# Altium project ITA-PCB.PrjPcb
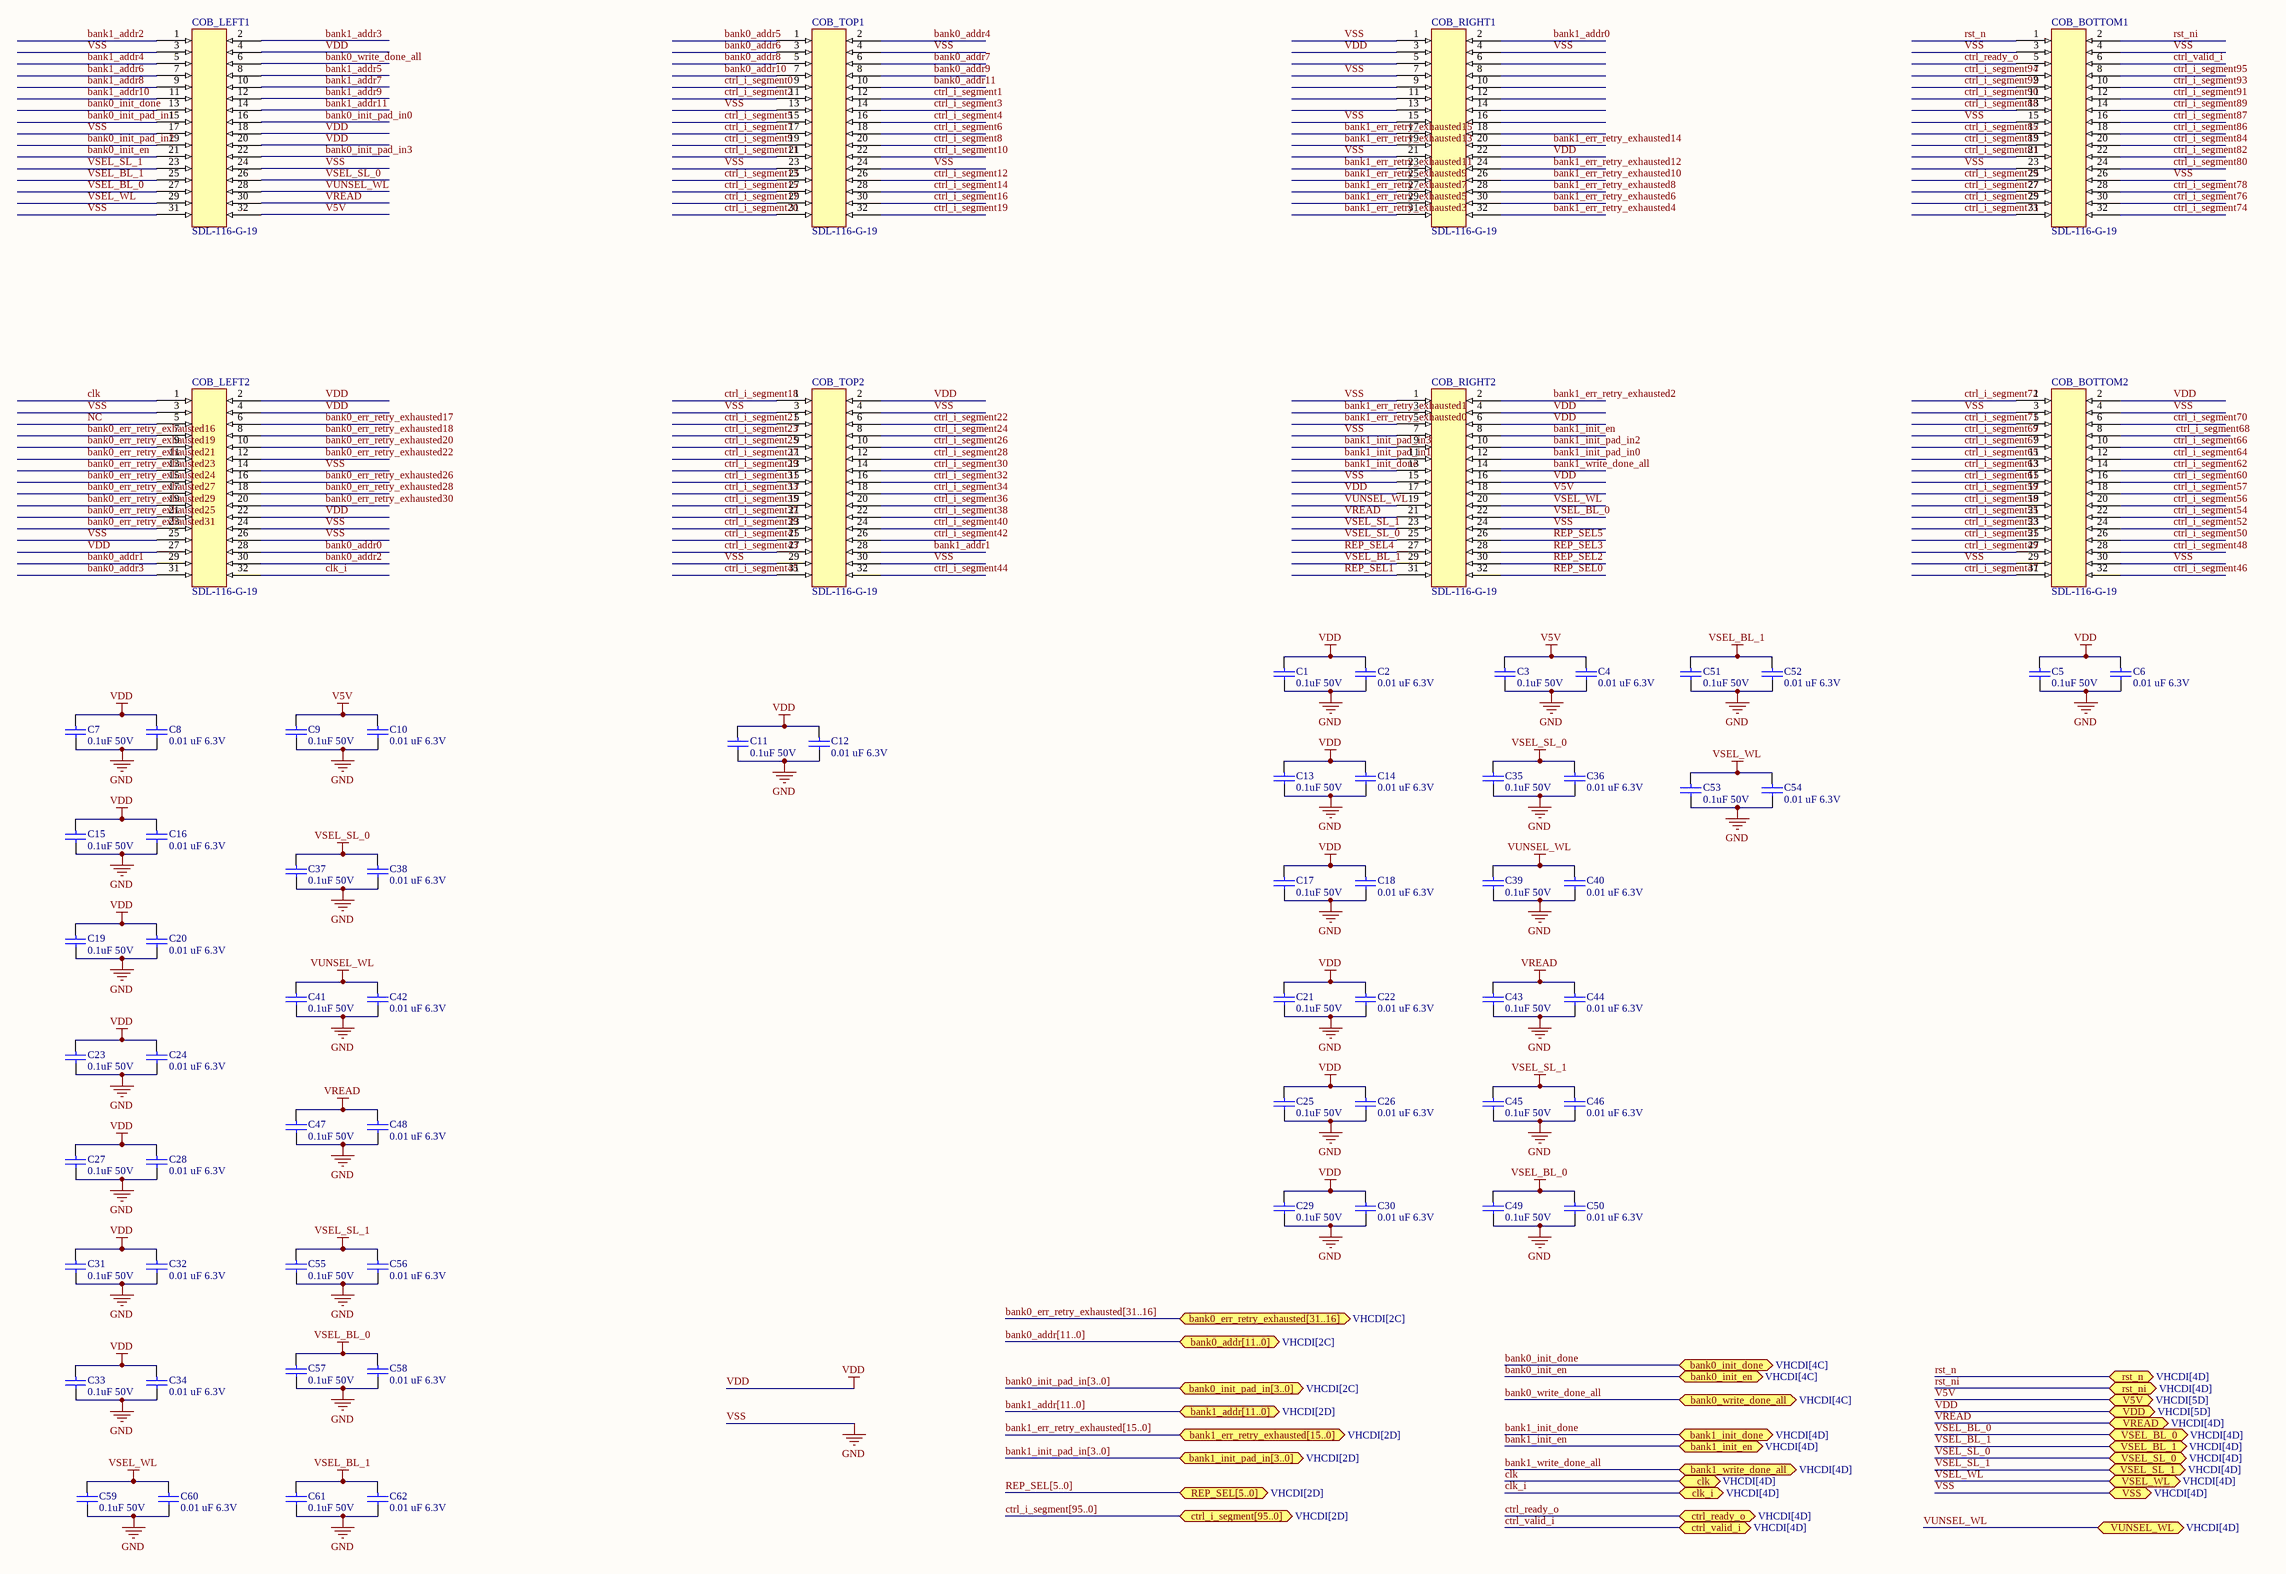
[diagram p0: COBConnector.SchDoc]
2 sheets, 77 parts. Net scope: flat (ports and power ports of the same name join across sheets).
Sheets:
  COBConnector.SchDoc
  VHCDI.SchDoc

## Sheet COBConnector.SchDoc
size C; SheetNumber: 2; SheetTotal: 2

### Parts
C1  0.1uF 50V  [C0603-XXXXXX-XXX]
C2  0.01 uF 6.3V  [C0603-XXXXXX-XXX]
C3  0.1uF 50V  [C0603-XXXXXX-XXX]
C4  0.01 uF 6.3V  [C0603-XXXXXX-XXX]
C5  0.1uF 50V  [C0603-XXXXXX-XXX]
C6  0.01 uF 6.3V  [C0603-XXXXXX-XXX]
C7  0.1uF 50V  [C0603-XXXXXX-XXX]
C8  0.01 uF 6.3V  [C0603-XXXXXX-XXX]
C9  0.1uF 50V  [C0603-XXXXXX-XXX]
C10  0.01 uF 6.3V  [C0603-XXXXXX-XXX]
C11  0.1uF 50V  [C0603-XXXXXX-XXX]
C12  0.01 uF 6.3V  [C0603-XXXXXX-XXX]
C13  0.1uF 50V  [C0603-XXXXXX-XXX]
C14  0.01 uF 6.3V  [C0603-XXXXXX-XXX]
C15  0.1uF 50V  [C0603-XXXXXX-XXX]
C16  0.01 uF 6.3V  [C0603-XXXXXX-XXX]
C17  0.1uF 50V  [C0603-XXXXXX-XXX]
C18  0.01 uF 6.3V  [C0603-XXXXXX-XXX]
C19  0.1uF 50V  [C0603-XXXXXX-XXX]
C20  0.01 uF 6.3V  [C0603-XXXXXX-XXX]
C21  0.1uF 50V  [C0603-XXXXXX-XXX]
C22  0.01 uF 6.3V  [C0603-XXXXXX-XXX]
C23  0.1uF 50V  [C0603-XXXXXX-XXX]
C24  0.01 uF 6.3V  [C0603-XXXXXX-XXX]
C25  0.1uF 50V  [C0603-XXXXXX-XXX]
C26  0.01 uF 6.3V  [C0603-XXXXXX-XXX]
C27  0.1uF 50V  [C0603-XXXXXX-XXX]
C28  0.01 uF 6.3V  [C0603-XXXXXX-XXX]
C29  0.1uF 50V  [C0603-XXXXXX-XXX]
C30  0.01 uF 6.3V  [C0603-XXXXXX-XXX]
C31  0.1uF 50V  [C0603-XXXXXX-XXX]
C32  0.01 uF 6.3V  [C0603-XXXXXX-XXX]
C33  0.1uF 50V  [C0603-XXXXXX-XXX]
C34  0.01 uF 6.3V  [C0603-XXXXXX-XXX]
C35  0.1uF 50V  [C0603-XXXXXX-XXX]
C36  0.01 uF 6.3V  [C0603-XXXXXX-XXX]
C37  0.1uF 50V  [C0603-XXXXXX-XXX]
C38  0.01 uF 6.3V  [C0603-XXXXXX-XXX]
C39  0.1uF 50V  [C0603-XXXXXX-XXX]
C40  0.01 uF 6.3V  [C0603-XXXXXX-XXX]
C41  0.1uF 50V  [C0603-XXXXXX-XXX]
C42  0.01 uF 6.3V  [C0603-XXXXXX-XXX]
C43  0.1uF 50V  [C0603-XXXXXX-XXX]
C44  0.01 uF 6.3V  [C0603-XXXXXX-XXX]
C45  0.1uF 50V  [C0603-XXXXXX-XXX]
C46  0.01 uF 6.3V  [C0603-XXXXXX-XXX]
C47  0.1uF 50V  [C0603-XXXXXX-XXX]
C48  0.01 uF 6.3V  [C0603-XXXXXX-XXX]
C49  0.1uF 50V  [C0603-XXXXXX-XXX]
C50  0.01 uF 6.3V  [C0603-XXXXXX-XXX]
C51  0.1uF 50V  [C0603-XXXXXX-XXX]
C52  0.01 uF 6.3V  [C0603-XXXXXX-XXX]
C53  0.1uF 50V  [C0603-XXXXXX-XXX]
C54  0.01 uF 6.3V  [C0603-XXXXXX-XXX]
C55  0.1uF 50V  [C0603-XXXXXX-XXX]
C56  0.01 uF 6.3V  [C0603-XXXXXX-XXX]
C57  0.1uF 50V  [C0603-XXXXXX-XXX]
C58  0.01 uF 6.3V  [C0603-XXXXXX-XXX]
C59  0.1uF 50V  [C0603-XXXXXX-XXX]
C60  0.01 uF 6.3V  [C0603-XXXXXX-XXX]
C61  0.1uF 50V  [C0603-XXXXXX-XXX]
C62  0.01 uF 6.3V  [C0603-XXXXXX-XXX]
COB_BOTTOM1  SDL-116-G-19  [CON32_2X16_TU_DSL_SAI]
COB_BOTTOM2  SDL-116-G-19  [CON32_2X16_TU_DSL_SAI]
COB_LEFT1  SDL-116-G-19  [CON32_2X16_TU_DSL_SAI]
COB_LEFT2  SDL-116-G-19  [CON32_2X16_TU_DSL_SAI]
COB_RIGHT1  SDL-116-G-19  [CON32_2X16_TU_DSL_SAI]
COB_RIGHT2  SDL-116-G-19  [CON32_2X16_TU_DSL_SAI]
COB_TOP1  SDL-116-G-19  [CON32_2X16_TU_DSL_SAI]
COB_TOP2  SDL-116-G-19  [CON32_2X16_TU_DSL_SAI]

### Ports
bank0_addr[11..0] (bidir, see VHCDI[2C]), bank0_err_retry_exhausted[31..16] (bidir, see VHCDI[2C]), bank0_init_done (bidir, see VHCDI[4C]), bank0_init_en (bidir, see VHCDI[4C]), bank0_init_pad_in[3..0] (bidir, see VHCDI[2C]), bank0_write_done_all (bidir, see VHCDI[4C]), bank1_addr[11..0] (bidir, see VHCDI[2D]), bank1_err_retry_exhausted[15..0] (bidir, see VHCDI[2D]), bank1_init_done (bidir, see VHCDI[4D]), bank1_init_en (bidir, see VHCDI[4D]), bank1_init_pad_in[3..0] (bidir, see VHCDI[2D]), bank1_write_done_all (bidir, see VHCDI[4D]), clk (bidir, see VHCDI[4D]), clk_i (bidir, see VHCDI[4D]), ctrl_i_segment[95..0] (bidir, see VHCDI[2D]), ctrl_ready_o (bidir, see VHCDI[4D]), ctrl_valid_i (bidir, see VHCDI[4D]), REP_SEL[5..0] (bidir, see VHCDI[2D]), rst_n (bidir, see VHCDI[4D]), rst_ni (bidir, see VHCDI[4D]), V5V (bidir, see VHCDI[5D]), VDD (bidir, see VHCDI[5D]), VREAD (bidir, see VHCDI[4D]), VSEL_BL_0 (bidir, see VHCDI[4D]), VSEL_BL_1 (bidir, see VHCDI[4D]), VSEL_SL_0 (bidir, see VHCDI[4D]), VSEL_SL_1 (bidir, see VHCDI[4D]), VSEL_WL (bidir, see VHCDI[4D]), VSS (bidir, see VHCDI[4D]), VUNSEL_WL (bidir, see VHCDI[4D])

### Nets
V5V: C3.1 C4.1 C9.1 C10.1 COB_LEFT1.32 COB_RIGHT2.18 ; port V5V
VDD: C1.1 C2.1 C5.1 C6.1 C7.1 C8.1 C11.1 C12.1 C13.1 C14.1 C15.1 C16.1 C17.1 C18.1 C19.1 C20.1 C21.1 C22.1 C23.1 C24.1 C25.1 C26.1 C27.1 C28.1 C29.1 C30.1 C31.1 C32.1 C33.1 C34.1 COB_BOTTOM2.2 COB_LEFT1.4 COB_LEFT1.18 COB_LEFT1.20 COB_LEFT2.2 COB_LEFT2.4 COB_LEFT2.22 COB_LEFT2.27 COB_RIGHT1.3 COB_RIGHT1.22 COB_RIGHT2.4 COB_RIGHT2.6 COB_RIGHT2.16 COB_RIGHT2.17 COB_TOP2.2 ; port VDD
VREAD: C43.1 C44.1 C47.1 C48.1 COB_LEFT1.30 COB_RIGHT2.21 ; port VREAD
VSEL_BL_0: C49.1 C50.1 C57.1 C58.1 COB_LEFT1.27 COB_RIGHT2.22 ; port VSEL_BL_0
VSEL_BL_1: C51.1 C52.1 C61.1 C62.1 COB_LEFT1.25 COB_RIGHT2.29 ; port VSEL_BL_1
VSEL_SL_0: C35.1 C36.1 C37.1 C38.1 COB_LEFT1.26 COB_RIGHT2.25 ; port VSEL_SL_0
VSEL_SL_1: C45.1 C46.1 C55.1 C56.1 COB_LEFT1.23 COB_RIGHT2.23 ; port VSEL_SL_1
VSEL_WL: C53.1 C54.1 C59.1 C60.1 COB_LEFT1.29 COB_RIGHT2.20 ; port VSEL_WL
VSS: C1.2 C2.2 C3.2 C4.2 C5.2 C6.2 C7.2 C8.2 C9.2 C10.2 C11.2 C12.2 C13.2 C14.2 C15.2 C16.2 C17.2 C18.2 C19.2 C20.2 C21.2 C22.2 C23.2 C24.2 C25.2 C26.2 C27.2 C28.2 C29.2 C30.2 C31.2 C32.2 C33.2 C34.2 C35.2 C36.2 C37.2 C38.2 C39.2 C40.2 C41.2 C42.2 C43.2 C44.2 C45.2 C46.2 C47.2 C48.2 C49.2 C50.2 C51.2 C52.2 C53.2 C54.2 C55.2 C56.2 C57.2 C58.2 C59.2 C60.2 C61.2 C62.2 COB_BOTTOM1.3 COB_BOTTOM1.4 COB_BOTTOM1.15 COB_BOTTOM1.23 COB_BOTTOM1.26 COB_BOTTOM2.3 COB_BOTTOM2.4 COB_BOTTOM2.29 COB_BOTTOM2.30 COB_LEFT1.3 COB_LEFT1.17 COB_LEFT1.24 COB_LEFT1.31 COB_LEFT2.3 COB_LEFT2.14 COB_LEFT2.24 COB_LEFT2.25 COB_LEFT2.26 COB_RIGHT1.1 COB_RIGHT1.4 COB_RIGHT1.7 COB_RIGHT1.15 COB_RIGHT1.21 COB_RIGHT2.1 COB_RIGHT2.7 COB_RIGHT2.15 COB_RIGHT2.24 COB_TOP1.4 COB_TOP1.13 COB_TOP1.23 COB_TOP1.24 COB_TOP2.3 COB_TOP2.4 COB_TOP2.29 COB_TOP2.30 ; port VSS  [also labelled GND]
VUNSEL_WL: C39.1 C40.1 C41.1 C42.1 COB_LEFT1.28 COB_RIGHT2.19 ; port VUNSEL_WL
bank0_addr0: COB_LEFT2.28
bank0_addr1: COB_LEFT2.29
bank0_addr2: COB_LEFT2.30
bank0_addr3: COB_LEFT2.31
bank0_addr4: COB_TOP1.2
bank0_addr5: COB_TOP1.1
bank0_addr6: COB_TOP1.3
bank0_addr7: COB_TOP1.6
bank0_addr8: COB_TOP1.5
bank0_addr9: COB_TOP1.8
bank0_addr10: COB_TOP1.7
bank0_addr11: COB_TOP1.10
bank0_err_retry_exhausted16: COB_LEFT2.7
bank0_err_retry_exhausted17: COB_LEFT2.6
bank0_err_retry_exhausted18: COB_LEFT2.8
bank0_err_retry_exhausted19: COB_LEFT2.9
bank0_err_retry_exhausted20: COB_LEFT2.10
bank0_err_retry_exhausted21: COB_LEFT2.11
bank0_err_retry_exhausted22: COB_LEFT2.12
bank0_err_retry_exhausted23: COB_LEFT2.13
bank0_err_retry_exhausted24: COB_LEFT2.15
bank0_err_retry_exhausted25: COB_LEFT2.21
bank0_err_retry_exhausted26: COB_LEFT2.16
bank0_err_retry_exhausted27: COB_LEFT2.17
bank0_err_retry_exhausted28: COB_LEFT2.18
bank0_err_retry_exhausted29: COB_LEFT2.19
bank0_err_retry_exhausted30: COB_LEFT2.20
bank0_err_retry_exhausted31: COB_LEFT2.23
bank0_init_done: COB_LEFT1.13 ; port bank0_init_done
bank0_init_en: COB_LEFT1.21 ; port bank0_init_en
bank0_init_pad_in0: COB_LEFT1.16
bank0_init_pad_in1: COB_LEFT1.15
bank0_init_pad_in2: COB_LEFT1.19
bank0_init_pad_in3: COB_LEFT1.22
bank0_write_done_all: COB_LEFT1.6 ; port bank0_write_done_all
bank1_addr0: COB_RIGHT1.2
bank1_addr1: COB_TOP2.28
bank1_addr2: COB_LEFT1.1
bank1_addr3: COB_LEFT1.2
bank1_addr4: COB_LEFT1.5
bank1_addr5: COB_LEFT1.8
bank1_addr6: COB_LEFT1.7
bank1_addr7: COB_LEFT1.10
bank1_addr8: COB_LEFT1.9
bank1_addr9: COB_LEFT1.12
bank1_addr10: COB_LEFT1.11
bank1_addr11: COB_LEFT1.14
bank1_err_retry_exhausted0: COB_RIGHT2.5
bank1_err_retry_exhausted1: COB_RIGHT2.3
bank1_err_retry_exhausted2: COB_RIGHT2.2
bank1_err_retry_exhausted3: COB_RIGHT1.31
bank1_err_retry_exhausted4: COB_RIGHT1.32
bank1_err_retry_exhausted5: COB_RIGHT1.29
bank1_err_retry_exhausted6: COB_RIGHT1.30
bank1_err_retry_exhausted7: COB_RIGHT1.27
bank1_err_retry_exhausted8: COB_RIGHT1.28
bank1_err_retry_exhausted9: COB_RIGHT1.25
bank1_err_retry_exhausted10: COB_RIGHT1.26
bank1_err_retry_exhausted11: COB_RIGHT1.23
bank1_err_retry_exhausted12: COB_RIGHT1.24
bank1_err_retry_exhausted13: COB_RIGHT1.19
bank1_err_retry_exhausted14: COB_RIGHT1.20
bank1_err_retry_exhausted15: COB_RIGHT1.17
bank1_init_done: COB_RIGHT2.13 ; port bank1_init_done
bank1_init_en: COB_RIGHT2.8 ; port bank1_init_en
bank1_init_pad_in0: COB_RIGHT2.12
bank1_init_pad_in1: COB_RIGHT2.11
bank1_init_pad_in2: COB_RIGHT2.10
bank1_init_pad_in3: COB_RIGHT2.9
bank1_write_done_all: COB_RIGHT2.14 ; port bank1_write_done_all
clk: COB_LEFT2.1 ; port clk
clk_i: COB_LEFT2.32 ; port clk_i
ctrl_i_segment0: COB_TOP1.9
ctrl_i_segment1: COB_TOP1.12
ctrl_i_segment2: COB_TOP1.11
ctrl_i_segment3: COB_TOP1.14
ctrl_i_segment4: COB_TOP1.16
ctrl_i_segment5: COB_TOP1.15
ctrl_i_segment6: COB_TOP1.18
ctrl_i_segment7: COB_TOP1.17
ctrl_i_segment8: COB_TOP1.20
ctrl_i_segment9: COB_TOP1.19
ctrl_i_segment10: COB_TOP1.22
ctrl_i_segment11: COB_TOP1.21
ctrl_i_segment12: COB_TOP1.26
ctrl_i_segment13: COB_TOP1.25
ctrl_i_segment14: COB_TOP1.28
ctrl_i_segment15: COB_TOP1.27
ctrl_i_segment16: COB_TOP1.30
ctrl_i_segment17: COB_TOP1.29
ctrl_i_segment18: COB_TOP2.1
ctrl_i_segment19: COB_TOP1.32
ctrl_i_segment20: COB_TOP1.31
ctrl_i_segment21: COB_TOP2.5
ctrl_i_segment22: COB_TOP2.6
ctrl_i_segment23: COB_TOP2.7
ctrl_i_segment24: COB_TOP2.8
ctrl_i_segment25: COB_TOP2.9
ctrl_i_segment26: COB_TOP2.10
ctrl_i_segment27: COB_TOP2.11
ctrl_i_segment28: COB_TOP2.12
ctrl_i_segment29: COB_TOP2.13
ctrl_i_segment30: COB_TOP2.14
ctrl_i_segment31: COB_TOP2.15
ctrl_i_segment32: COB_TOP2.16
ctrl_i_segment33: COB_TOP2.17
ctrl_i_segment34: COB_TOP2.18
ctrl_i_segment35: COB_TOP2.19
ctrl_i_segment36: COB_TOP2.20
ctrl_i_segment37: COB_TOP2.21
ctrl_i_segment38: COB_TOP2.22
ctrl_i_segment39: COB_TOP2.23
ctrl_i_segment40: COB_TOP2.24
ctrl_i_segment41: COB_TOP2.25
ctrl_i_segment42: COB_TOP2.26
ctrl_i_segment43: COB_TOP2.27
ctrl_i_segment44: COB_TOP2.32
ctrl_i_segment45: COB_TOP2.31
ctrl_i_segment46: COB_BOTTOM2.32
ctrl_i_segment47: COB_BOTTOM2.31
ctrl_i_segment48: COB_BOTTOM2.28
ctrl_i_segment49: COB_BOTTOM2.27
ctrl_i_segment50: COB_BOTTOM2.26
ctrl_i_segment51: COB_BOTTOM2.25
ctrl_i_segment52: COB_BOTTOM2.24
ctrl_i_segment53: COB_BOTTOM2.23
ctrl_i_segment54: COB_BOTTOM2.22
ctrl_i_segment55: COB_BOTTOM2.21
ctrl_i_segment56: COB_BOTTOM2.20
ctrl_i_segment57: COB_BOTTOM2.18
ctrl_i_segment58: COB_BOTTOM2.19
ctrl_i_segment59: COB_BOTTOM2.17
ctrl_i_segment60: COB_BOTTOM2.16
ctrl_i_segment61: COB_BOTTOM2.15
ctrl_i_segment62: COB_BOTTOM2.14
ctrl_i_segment63: COB_BOTTOM2.13
ctrl_i_segment64: COB_BOTTOM2.12
ctrl_i_segment65: COB_BOTTOM2.11
ctrl_i_segment66: COB_BOTTOM2.10
ctrl_i_segment67: COB_BOTTOM2.9
ctrl_i_segment68: COB_BOTTOM2.8
ctrl_i_segment69: COB_BOTTOM2.7
ctrl_i_segment70: COB_BOTTOM2.6
ctrl_i_segment71: COB_BOTTOM2.5
ctrl_i_segment72: COB_BOTTOM2.1
ctrl_i_segment73: COB_BOTTOM1.31
ctrl_i_segment74: COB_BOTTOM1.32
ctrl_i_segment75: COB_BOTTOM1.29
ctrl_i_segment76: COB_BOTTOM1.30
ctrl_i_segment77: COB_BOTTOM1.27
ctrl_i_segment78: COB_BOTTOM1.28
ctrl_i_segment79: COB_BOTTOM1.25
ctrl_i_segment80: COB_BOTTOM1.24
ctrl_i_segment81: COB_BOTTOM1.21
ctrl_i_segment82: COB_BOTTOM1.22
ctrl_i_segment83: COB_BOTTOM1.19
ctrl_i_segment84: COB_BOTTOM1.20
ctrl_i_segment85: COB_BOTTOM1.17
ctrl_i_segment86: COB_BOTTOM1.18
ctrl_i_segment87: COB_BOTTOM1.16
ctrl_i_segment88: COB_BOTTOM1.13
ctrl_i_segment89: COB_BOTTOM1.14
ctrl_i_segment90: COB_BOTTOM1.11
ctrl_i_segment91: COB_BOTTOM1.12
ctrl_i_segment92: COB_BOTTOM1.9
ctrl_i_segment93: COB_BOTTOM1.10
ctrl_i_segment94: COB_BOTTOM1.7
ctrl_i_segment95: COB_BOTTOM1.8
ctrl_ready_o: COB_BOTTOM1.5 ; port ctrl_ready_o
ctrl_valid_i: COB_BOTTOM1.6 ; port ctrl_valid_i
NC: COB_LEFT2.5
REP_SEL0: COB_RIGHT2.32
REP_SEL1: COB_RIGHT2.31
REP_SEL2: COB_RIGHT2.30
REP_SEL3: COB_RIGHT2.28
REP_SEL4: COB_RIGHT2.27
REP_SEL5: COB_RIGHT2.26
rst_n: COB_BOTTOM1.1 ; port rst_n
rst_ni: COB_BOTTOM1.2 ; port rst_ni

Not connected (* = marked no-connect by the designer): COB_RIGHT1 5 6 8 9 10 11 12 13 14 16 18

### Buses and harness runs
bus bank0_addr[11..0] = port bank0_addr[11..0]
bus bank0_err_retry_exhausted[31..16] = port bank0_err_retry_exhausted[31..16]
bus bank0_init_pad_in[3..0] = port bank0_init_pad_in[3..0]
bus bank1_addr[11..0] = port bank1_addr[11..0]
bus bank1_err_retry_exhausted[15..0] = port bank1_err_retry_exhausted[15..0]
bus bank1_init_pad_in[3..0] = port bank1_init_pad_in[3..0]
bus ctrl_i_segment[95..0] = port ctrl_i_segment[95..0]
bus REP_SEL[5..0] = port REP_SEL[5..0]

### Library data of the parts
C1 C3 C5 C7 C9 C11 C13 C15 C17 C19 C21 C23 C25 C27 C29 C31 C33 C35 C37 C39 C41 C43 C45 C47 C49 C51 C53 C55 C57 C59 C61 = C0603C104M5RAC7867: 0.1 µF ±20% 50V Ceramic Capacitor X7R 0603; KMI: 821327; Value: 0.1uF 50V
C2 C4 C6 C8 C10 C12 C14 C16 C18 C20 C22 C24 C26 C28 C30 C32 C34 C36 C38 C40 C42 C44 C46 C48 C50 C52 C54 C56 C58 C60 C62 = C0603F103M9RACTU: Multilayer Ceramic Capacitors MLCC - SMD/SMT 6.3V 0.01uF X7R 0603 20%; Value: 0.01 uF 6.3V

## Sheet VHCDI.SchDoc
size C; SheetNumber: 1; SheetTotal: 2
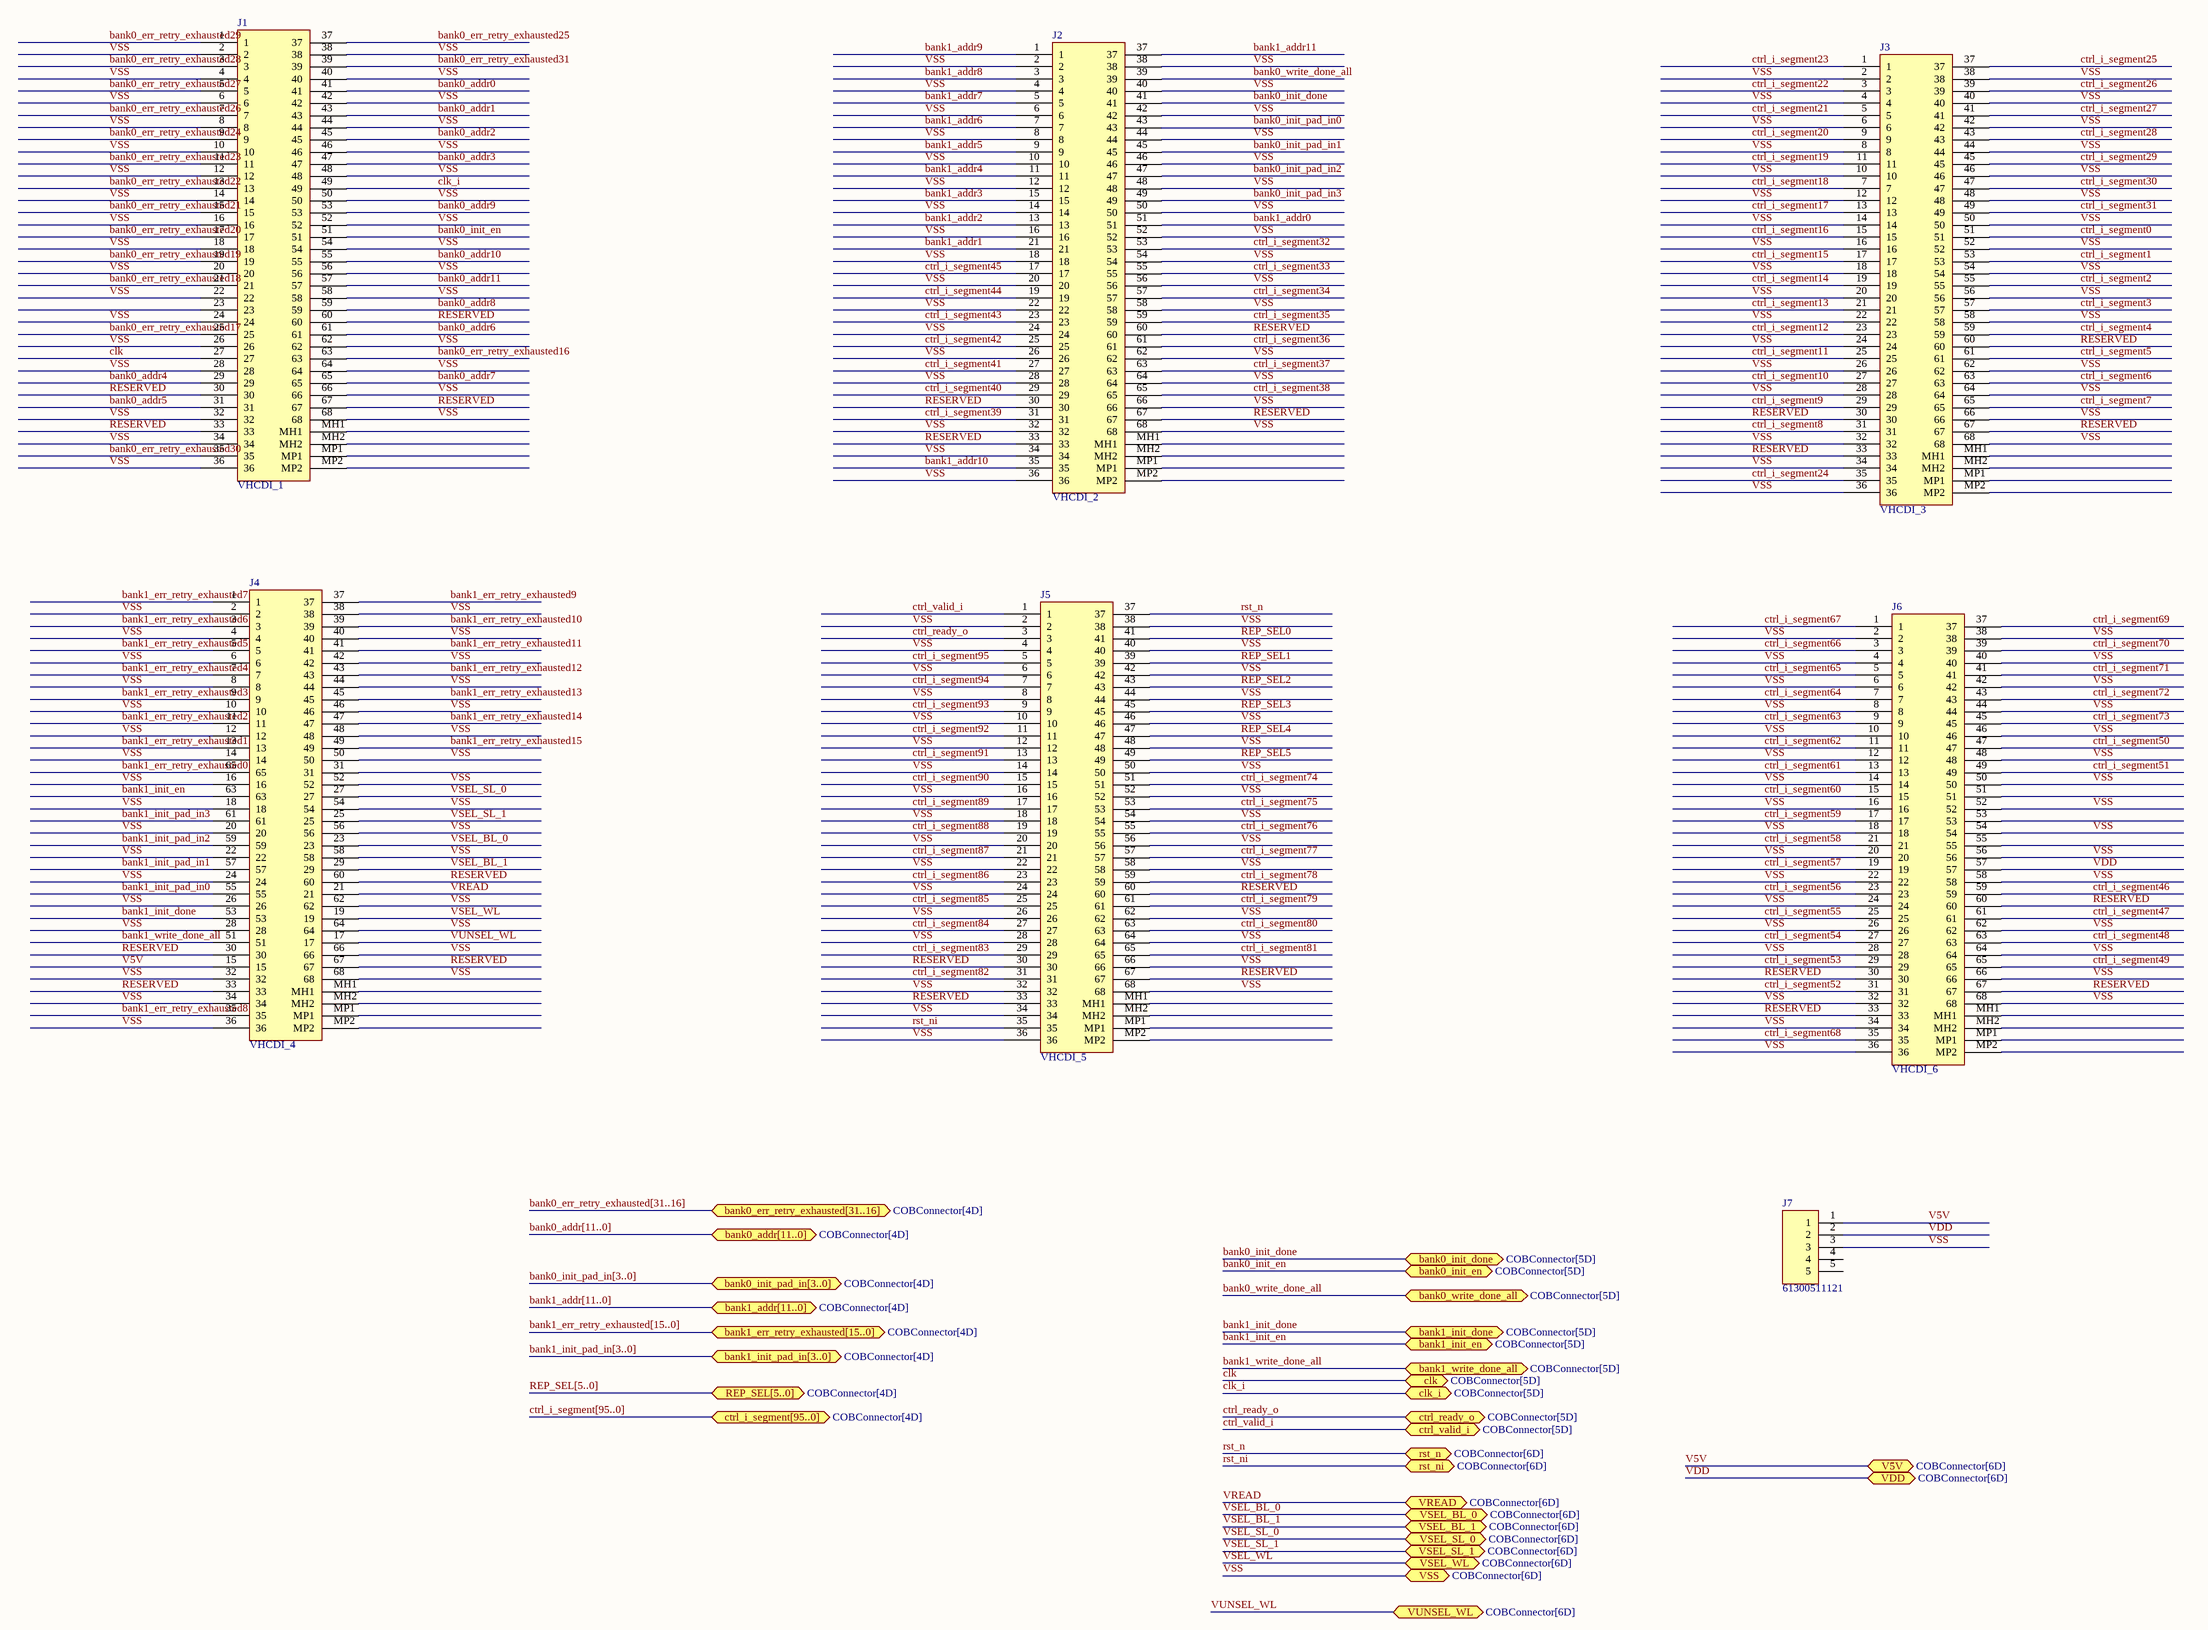
[diagram p1: VHCDI.SchDoc]

### Parts
J1  VHCDI_1  [CONN68_HDRA-EC_HON]
J2  VHCDI_2  [CONN68_HDRA-EC_HON]
J3  VHCDI_3  [CONN68_HDRA-EC_HON]
J4  VHCDI_4  [CONN68_HDRA-EC_HON]
J5  VHCDI_5  [CONN68_HDRA-EC_HON]
J6  VHCDI_6  [CONN68_HDRA-EC_HON]
J7  61300511121  [HDRV5W64P0X254_1X5_1270X254X854P]

### Ports
bank0_addr[11..0] (bidir, see COBConnector[4D]), bank0_err_retry_exhausted[31..16] (bidir, see COBConnector[4D]), bank0_init_done (bidir, see COBConnector[5D]), bank0_init_en (bidir, see COBConnector[5D]), bank0_init_pad_in[3..0] (bidir, see COBConnector[4D]), bank0_write_done_all (bidir, see COBConnector[5D]), bank1_addr[11..0] (bidir, see COBConnector[4D]), bank1_err_retry_exhausted[15..0] (bidir, see COBConnector[4D]), bank1_init_done (bidir, see COBConnector[5D]), bank1_init_en (bidir, see COBConnector[5D]), bank1_init_pad_in[3..0] (bidir, see COBConnector[4D]), bank1_write_done_all (bidir, see COBConnector[5D]), clk (bidir, see COBConnector[5D]), clk_i (bidir, see COBConnector[5D]), ctrl_i_segment[95..0] (bidir, see COBConnector[4D]), ctrl_ready_o (bidir, see COBConnector[5D]), ctrl_valid_i (bidir, see COBConnector[5D]), REP_SEL[5..0] (bidir, see COBConnector[4D]), rst_n (bidir, see COBConnector[6D]), rst_ni (bidir, see COBConnector[6D]), V5V (bidir, see COBConnector[6D]), VDD (bidir, see COBConnector[6D]), VREAD (bidir, see COBConnector[6D]), VSEL_BL_0 (bidir, see COBConnector[6D]), VSEL_BL_1 (bidir, see COBConnector[6D]), VSEL_SL_0 (bidir, see COBConnector[6D]), VSEL_SL_1 (bidir, see COBConnector[6D]), VSEL_WL (bidir, see COBConnector[6D]), VSS (bidir, see COBConnector[6D]), VUNSEL_WL (bidir, see COBConnector[6D])

### Nets
V5V: J4.15 J7.1 ; port V5V
VDD: J6.57 J7.2 ; port VDD
VREAD: J4.21 ; port VREAD
VSEL_BL_0: J4.23 ; port VSEL_BL_0
VSEL_BL_1: J4.29 ; port VSEL_BL_1
VSEL_SL_0: J4.27 ; port VSEL_SL_0
VSEL_SL_1: J4.25 ; port VSEL_SL_1
VSEL_WL: J4.19 ; port VSEL_WL
VSS: J1.2 J1.4 J1.6 J1.8 J1.10 J1.12 J1.14 J1.16 J1.18 J1.20 J1.22 J1.24 J1.26 J1.28 J1.32 J1.34 J1.36 J1.38 J1.40 J1.42 J1.44 J1.46 J1.48 J1.50 J1.52 J1.54 J1.56 J1.58 J1.62 J1.64 J1.66 J1.68 J2.2 J2.4 J2.6 J2.8 J2.10 J2.12 J2.14 J2.16 J2.18 J2.20 J2.22 J2.24 J2.26 J2.28 J2.32 J2.34 J2.36 J2.38 J2.40 J2.42 J2.44 J2.46 J2.48 J2.50 J2.52 J2.54 J2.56 J2.58 J2.62 J2.64 J2.66 J2.68 J3.2 J3.4 J3.6 J3.8 J3.10 J3.12 J3.14 J3.16 J3.18 J3.20 J3.22 J3.24 J3.26 J3.28 J3.32 J3.34 J3.36 J3.38 J3.40 J3.42 J3.44 J3.46 J3.48 J3.50 J3.52 J3.54 J3.56 J3.58 J3.62 J3.64 J3.66 J3.68 J4.2 J4.4 J4.6 J4.8 J4.10 J4.12 J4.14 J4.16 J4.18 J4.20 J4.22 J4.24 J4.26 J4.28 J4.32 J4.34 J4.36 J4.38 J4.40 J4.42 J4.44 J4.46 J4.48 J4.50 J4.52 J4.54 J4.56 J4.58 J4.62 J4.64 J4.66 J4.68 J5.2 J5.4 J5.6 J5.8 J5.10 J5.12 J5.14 J5.16 J5.18 J5.20 J5.22 J5.24 J5.26 J5.28 J5.32 J5.34 J5.36 J5.38 J5.40 J5.42 J5.44 J5.46 J5.48 J5.50 J5.52 J5.54 J5.56 J5.58 J5.62 J5.64 J5.66 J5.68 J6.2 J6.4 J6.6 J6.8 J6.10 J6.12 J6.14 J6.16 J6.18 J6.20 J6.22 J6.24 J6.26 J6.28 J6.32 J6.34 J6.36 J6.38 J6.40 J6.42 J6.44 J6.46 J6.48 J6.50 J6.52 J6.54 J6.56 J6.58 J6.62 J6.64 J6.66 J6.68 J7.3 ; port VSS
VUNSEL_WL: J4.17 ; port VUNSEL_WL
bank0_addr0: J1.41
bank0_addr1: J1.43
bank0_addr2: J1.45
bank0_addr3: J1.47
bank0_addr4: J1.29
bank0_addr5: J1.31
bank0_addr6: J1.61
bank0_addr7: J1.65
bank0_addr8: J1.59
bank0_addr9: J1.53
bank0_addr10: J1.55
bank0_addr11: J1.57
bank0_err_retry_exhausted16: J1.63
bank0_err_retry_exhausted17: J1.25
bank0_err_retry_exhausted18: J1.21
bank0_err_retry_exhausted19: J1.19
bank0_err_retry_exhausted20: J1.17
bank0_err_retry_exhausted21: J1.15
bank0_err_retry_exhausted22: J1.13
bank0_err_retry_exhausted23: J1.11
bank0_err_retry_exhausted24: J1.9
bank0_err_retry_exhausted25: J1.37
bank0_err_retry_exhausted26: J1.7
bank0_err_retry_exhausted27: J1.5
bank0_err_retry_exhausted28: J1.3
bank0_err_retry_exhausted29: J1.1
bank0_err_retry_exhausted30: J1.35
bank0_err_retry_exhausted31: J1.39
bank0_init_done: J2.41 ; port bank0_init_done
bank0_init_en: J1.51 ; port bank0_init_en
bank0_init_pad_in0: J2.43
bank0_init_pad_in1: J2.45
bank0_init_pad_in2: J2.47
bank0_init_pad_in3: J2.49
bank0_write_done_all: J2.39 ; port bank0_write_done_all
bank1_addr0: J2.51
bank1_addr1: J2.21
bank1_addr2: J2.13
bank1_addr3: J2.15
bank1_addr4: J2.11
bank1_addr5: J2.9
bank1_addr6: J2.7
bank1_addr7: J2.5
bank1_addr8: J2.3
bank1_addr9: J2.1
bank1_addr10: J2.35
bank1_addr11: J2.37
bank1_err_retry_exhausted0: J4.65
bank1_err_retry_exhausted1: J4.13
bank1_err_retry_exhausted2: J4.11
bank1_err_retry_exhausted3: J4.9
bank1_err_retry_exhausted4: J4.7
bank1_err_retry_exhausted5: J4.5
bank1_err_retry_exhausted6: J4.3
bank1_err_retry_exhausted7: J4.1
bank1_err_retry_exhausted8: J4.35
bank1_err_retry_exhausted9: J4.37
bank1_err_retry_exhausted10: J4.39
bank1_err_retry_exhausted11: J4.41
bank1_err_retry_exhausted12: J4.43
bank1_err_retry_exhausted13: J4.45
bank1_err_retry_exhausted14: J4.47
bank1_err_retry_exhausted15: J4.49
bank1_init_done: J4.53 ; port bank1_init_done
bank1_init_en: J4.63 ; port bank1_init_en
bank1_init_pad_in0: J4.55
bank1_init_pad_in1: J4.57
bank1_init_pad_in2: J4.59
bank1_init_pad_in3: J4.61
bank1_write_done_all: J4.51 ; port bank1_write_done_all
clk: J1.27 ; port clk
clk_i: J1.49 ; port clk_i
ctrl_i_segment0: J3.51
ctrl_i_segment1: J3.53
ctrl_i_segment2: J3.55
ctrl_i_segment3: J3.57
ctrl_i_segment4: J3.59
ctrl_i_segment5: J3.61
ctrl_i_segment6: J3.63
ctrl_i_segment7: J3.65
ctrl_i_segment8: J3.31
ctrl_i_segment9: J3.29
ctrl_i_segment10: J3.27
ctrl_i_segment11: J3.25
ctrl_i_segment12: J3.23
ctrl_i_segment13: J3.21
ctrl_i_segment14: J3.19
ctrl_i_segment15: J3.17
ctrl_i_segment16: J3.15
ctrl_i_segment17: J3.13
ctrl_i_segment18: J3.7
ctrl_i_segment19: J3.11
ctrl_i_segment20: J3.9
ctrl_i_segment21: J3.5
ctrl_i_segment22: J3.3
ctrl_i_segment23: J3.1
ctrl_i_segment24: J3.35
ctrl_i_segment25: J3.37
ctrl_i_segment26: J3.39
ctrl_i_segment27: J3.41
ctrl_i_segment28: J3.43
ctrl_i_segment29: J3.45
ctrl_i_segment30: J3.47
ctrl_i_segment31: J3.49
ctrl_i_segment32: J2.53
ctrl_i_segment33: J2.55
ctrl_i_segment34: J2.57
ctrl_i_segment35: J2.59
ctrl_i_segment36: J2.61
ctrl_i_segment37: J2.63
ctrl_i_segment38: J2.65
ctrl_i_segment39: J2.31
ctrl_i_segment40: J2.29
ctrl_i_segment41: J2.27
ctrl_i_segment42: J2.25
ctrl_i_segment43: J2.23
ctrl_i_segment44: J2.19
ctrl_i_segment45: J2.17
ctrl_i_segment46: J6.59
ctrl_i_segment47: J6.61
ctrl_i_segment48: J6.63
ctrl_i_segment49: J6.65
ctrl_i_segment50: J6.47
ctrl_i_segment51: J6.49
ctrl_i_segment52: J6.31
ctrl_i_segment53: J6.29
ctrl_i_segment54: J6.27
ctrl_i_segment55: J6.25
ctrl_i_segment56: J6.23
ctrl_i_segment57: J6.19
ctrl_i_segment58: J6.21
ctrl_i_segment59: J6.17
ctrl_i_segment60: J6.15
ctrl_i_segment61: J6.13
ctrl_i_segment62: J6.11
ctrl_i_segment63: J6.9
ctrl_i_segment64: J6.7
ctrl_i_segment65: J6.5
ctrl_i_segment66: J6.3
ctrl_i_segment67: J6.1
ctrl_i_segment68: J6.35
ctrl_i_segment69: J6.37
ctrl_i_segment70: J6.39
ctrl_i_segment71: J6.41
ctrl_i_segment72: J6.43
ctrl_i_segment73: J6.45
ctrl_i_segment74: J5.51
ctrl_i_segment75: J5.53
ctrl_i_segment76: J5.55
ctrl_i_segment77: J5.57
ctrl_i_segment78: J5.59
ctrl_i_segment79: J5.61
ctrl_i_segment80: J5.63
ctrl_i_segment81: J5.65
ctrl_i_segment82: J5.31
ctrl_i_segment83: J5.29
ctrl_i_segment84: J5.27
ctrl_i_segment85: J5.25
ctrl_i_segment86: J5.23
ctrl_i_segment87: J5.21
ctrl_i_segment88: J5.19
ctrl_i_segment89: J5.17
ctrl_i_segment90: J5.15
ctrl_i_segment91: J5.13
ctrl_i_segment92: J5.11
ctrl_i_segment93: J5.9
ctrl_i_segment94: J5.7
ctrl_i_segment95: J5.5
ctrl_ready_o: J5.3 ; port ctrl_ready_o
ctrl_valid_i: J5.1 ; port ctrl_valid_i
REP_SEL0: J5.41
REP_SEL1: J5.39
REP_SEL2: J5.43
REP_SEL3: J5.45
REP_SEL4: J5.47
REP_SEL5: J5.49
RESERVED: J1.30 J1.33 J1.60 J1.67 J2.30 J2.33 J2.60 J2.67 J3.30 J3.33 J3.60 J3.67 J4.30 J4.33 J4.60 J4.67 J5.30 J5.33 J5.60 J5.67 J6.30 J6.33 J6.60 J6.67
rst_n: J5.37 ; port rst_n
rst_ni: J5.35 ; port rst_ni

Not connected (* = marked no-connect by the designer): J1 23 MH1 MH2 MP1 MP2; J2 MH1 MH2 MP1 MP2; J3 MH1 MH2 MP1 MP2; J4 31 MH1 MH2 MP1 MP2; J5 MH1 MH2 MP1 MP2; J6 51 53 55 MH1 MH2 MP1 MP2; J7 4 5

### Buses and harness runs
bus bank0_addr[11..0] = port bank0_addr[11..0]
bus bank0_err_retry_exhausted[31..16] = port bank0_err_retry_exhausted[31..16]
bus bank0_init_pad_in[3..0] = port bank0_init_pad_in[3..0]
bus bank1_addr[11..0] = port bank1_addr[11..0]
bus bank1_err_retry_exhausted[15..0] = port bank1_err_retry_exhausted[15..0]
bus bank1_init_pad_in[3..0] = port bank1_init_pad_in[3..0]
bus ctrl_i_segment[95..0] = port ctrl_i_segment[95..0]
bus REP_SEL[5..0] = port REP_SEL[5..0]

### Library data of the parts
J1-J6 = 785633-01: Connector; Manufacturer_Name: NI; Datasheet Link: https://www.digikey.com/en/products/detail/ni/785633-01/16637125?s=N4IgTCBcDaIOwA4CsA2AzGkBdAvkA; Height: 10.8mm; Manufacturer_Part_Number: 785633-01
J7 = 61300511121: Connector; Manufacturer_Name: Wurth Elektronik; Datasheet Link: http://katalog.we-online.de/em/datasheet/6130xx11121.pdf; Height: 8.54mm; Manufacturer_Part_Number: 61300511121; Mouser Part Number: 710-61300511121; Mouser Price/Stock: https://www.mouser.co.uk/ProductDetail/Wurth-Elektronik/61300511121?qs=PhR8RmCirEZCsCRHq%252BvfRQ%3D%3D

## Nets that join several sheets
V5V: COBConnector (6 pins), VHCDI (J4.15 J7.1)
VDD: COBConnector (45 pins), VHCDI (J6.57 J7.2)
VREAD: COBConnector (6 pins), VHCDI (J4.21)
VSEL_BL_0: COBConnector (6 pins), VHCDI (J4.23)
VSEL_BL_1: COBConnector (6 pins), VHCDI (J4.29)
VSEL_SL_0: COBConnector (6 pins), VHCDI (J4.27)
VSEL_SL_1: COBConnector (6 pins), VHCDI (J4.25)
VSEL_WL: COBConnector (6 pins), VHCDI (J4.19)
VSS: COBConnector (97 pins), VHCDI (193 pins)
VUNSEL_WL: COBConnector (6 pins), VHCDI (J4.17)
bank0_addr0: COBConnector (COB_LEFT2.28), VHCDI (J1.41)
bank0_addr1: COBConnector (COB_LEFT2.29), VHCDI (J1.43)
bank0_addr2: COBConnector (COB_LEFT2.30), VHCDI (J1.45)
bank0_addr3: COBConnector (COB_LEFT2.31), VHCDI (J1.47)
bank0_addr4: COBConnector (COB_TOP1.2), VHCDI (J1.29)
bank0_addr5: COBConnector (COB_TOP1.1), VHCDI (J1.31)
bank0_addr6: COBConnector (COB_TOP1.3), VHCDI (J1.61)
bank0_addr7: COBConnector (COB_TOP1.6), VHCDI (J1.65)
bank0_addr8: COBConnector (COB_TOP1.5), VHCDI (J1.59)
bank0_addr9: COBConnector (COB_TOP1.8), VHCDI (J1.53)
bank0_addr10: COBConnector (COB_TOP1.7), VHCDI (J1.55)
bank0_addr11: COBConnector (COB_TOP1.10), VHCDI (J1.57)
bank0_err_retry_exhausted16: COBConnector (COB_LEFT2.7), VHCDI (J1.63)
bank0_err_retry_exhausted17: COBConnector (COB_LEFT2.6), VHCDI (J1.25)
bank0_err_retry_exhausted18: COBConnector (COB_LEFT2.8), VHCDI (J1.21)
bank0_err_retry_exhausted19: COBConnector (COB_LEFT2.9), VHCDI (J1.19)
bank0_err_retry_exhausted20: COBConnector (COB_LEFT2.10), VHCDI (J1.17)
bank0_err_retry_exhausted21: COBConnector (COB_LEFT2.11), VHCDI (J1.15)
bank0_err_retry_exhausted22: COBConnector (COB_LEFT2.12), VHCDI (J1.13)
bank0_err_retry_exhausted23: COBConnector (COB_LEFT2.13), VHCDI (J1.11)
bank0_err_retry_exhausted24: COBConnector (COB_LEFT2.15), VHCDI (J1.9)
bank0_err_retry_exhausted25: COBConnector (COB_LEFT2.21), VHCDI (J1.37)
bank0_err_retry_exhausted26: COBConnector (COB_LEFT2.16), VHCDI (J1.7)
bank0_err_retry_exhausted27: COBConnector (COB_LEFT2.17), VHCDI (J1.5)
bank0_err_retry_exhausted28: COBConnector (COB_LEFT2.18), VHCDI (J1.3)
bank0_err_retry_exhausted29: COBConnector (COB_LEFT2.19), VHCDI (J1.1)
bank0_err_retry_exhausted30: COBConnector (COB_LEFT2.20), VHCDI (J1.35)
bank0_err_retry_exhausted31: COBConnector (COB_LEFT2.23), VHCDI (J1.39)
bank0_init_done: COBConnector (COB_LEFT1.13), VHCDI (J2.41)
bank0_init_en: COBConnector (COB_LEFT1.21), VHCDI (J1.51)
bank0_init_pad_in0: COBConnector (COB_LEFT1.16), VHCDI (J2.43)
bank0_init_pad_in1: COBConnector (COB_LEFT1.15), VHCDI (J2.45)
bank0_init_pad_in2: COBConnector (COB_LEFT1.19), VHCDI (J2.47)
bank0_init_pad_in3: COBConnector (COB_LEFT1.22), VHCDI (J2.49)
bank0_write_done_all: COBConnector (COB_LEFT1.6), VHCDI (J2.39)
bank1_addr0: COBConnector (COB_RIGHT1.2), VHCDI (J2.51)
bank1_addr1: COBConnector (COB_TOP2.28), VHCDI (J2.21)
bank1_addr2: COBConnector (COB_LEFT1.1), VHCDI (J2.13)
bank1_addr3: COBConnector (COB_LEFT1.2), VHCDI (J2.15)
bank1_addr4: COBConnector (COB_LEFT1.5), VHCDI (J2.11)
bank1_addr5: COBConnector (COB_LEFT1.8), VHCDI (J2.9)
bank1_addr6: COBConnector (COB_LEFT1.7), VHCDI (J2.7)
bank1_addr7: COBConnector (COB_LEFT1.10), VHCDI (J2.5)
bank1_addr8: COBConnector (COB_LEFT1.9), VHCDI (J2.3)
bank1_addr9: COBConnector (COB_LEFT1.12), VHCDI (J2.1)
bank1_addr10: COBConnector (COB_LEFT1.11), VHCDI (J2.35)
bank1_addr11: COBConnector (COB_LEFT1.14), VHCDI (J2.37)
bank1_err_retry_exhausted0: COBConnector (COB_RIGHT2.5), VHCDI (J4.65)
bank1_err_retry_exhausted1: COBConnector (COB_RIGHT2.3), VHCDI (J4.13)
bank1_err_retry_exhausted2: COBConnector (COB_RIGHT2.2), VHCDI (J4.11)
bank1_err_retry_exhausted3: COBConnector (COB_RIGHT1.31), VHCDI (J4.9)
bank1_err_retry_exhausted4: COBConnector (COB_RIGHT1.32), VHCDI (J4.7)
bank1_err_retry_exhausted5: COBConnector (COB_RIGHT1.29), VHCDI (J4.5)
bank1_err_retry_exhausted6: COBConnector (COB_RIGHT1.30), VHCDI (J4.3)
bank1_err_retry_exhausted7: COBConnector (COB_RIGHT1.27), VHCDI (J4.1)
bank1_err_retry_exhausted8: COBConnector (COB_RIGHT1.28), VHCDI (J4.35)
bank1_err_retry_exhausted9: COBConnector (COB_RIGHT1.25), VHCDI (J4.37)
bank1_err_retry_exhausted10: COBConnector (COB_RIGHT1.26), VHCDI (J4.39)
bank1_err_retry_exhausted11: COBConnector (COB_RIGHT1.23), VHCDI (J4.41)
bank1_err_retry_exhausted12: COBConnector (COB_RIGHT1.24), VHCDI (J4.43)
bank1_err_retry_exhausted13: COBConnector (COB_RIGHT1.19), VHCDI (J4.45)
bank1_err_retry_exhausted14: COBConnector (COB_RIGHT1.20), VHCDI (J4.47)
bank1_err_retry_exhausted15: COBConnector (COB_RIGHT1.17), VHCDI (J4.49)
bank1_init_done: COBConnector (COB_RIGHT2.13), VHCDI (J4.53)
bank1_init_en: COBConnector (COB_RIGHT2.8), VHCDI (J4.63)
bank1_init_pad_in0: COBConnector (COB_RIGHT2.12), VHCDI (J4.55)
bank1_init_pad_in1: COBConnector (COB_RIGHT2.11), VHCDI (J4.57)
bank1_init_pad_in2: COBConnector (COB_RIGHT2.10), VHCDI (J4.59)
bank1_init_pad_in3: COBConnector (COB_RIGHT2.9), VHCDI (J4.61)
bank1_write_done_all: COBConnector (COB_RIGHT2.14), VHCDI (J4.51)
clk: COBConnector (COB_LEFT2.1), VHCDI (J1.27)
clk_i: COBConnector (COB_LEFT2.32), VHCDI (J1.49)
ctrl_i_segment0: COBConnector (COB_TOP1.9), VHCDI (J3.51)
ctrl_i_segment1: COBConnector (COB_TOP1.12), VHCDI (J3.53)
ctrl_i_segment2: COBConnector (COB_TOP1.11), VHCDI (J3.55)
ctrl_i_segment3: COBConnector (COB_TOP1.14), VHCDI (J3.57)
ctrl_i_segment4: COBConnector (COB_TOP1.16), VHCDI (J3.59)
ctrl_i_segment5: COBConnector (COB_TOP1.15), VHCDI (J3.61)
ctrl_i_segment6: COBConnector (COB_TOP1.18), VHCDI (J3.63)
ctrl_i_segment7: COBConnector (COB_TOP1.17), VHCDI (J3.65)
ctrl_i_segment8: COBConnector (COB_TOP1.20), VHCDI (J3.31)
ctrl_i_segment9: COBConnector (COB_TOP1.19), VHCDI (J3.29)
ctrl_i_segment10: COBConnector (COB_TOP1.22), VHCDI (J3.27)
ctrl_i_segment11: COBConnector (COB_TOP1.21), VHCDI (J3.25)
ctrl_i_segment12: COBConnector (COB_TOP1.26), VHCDI (J3.23)
ctrl_i_segment13: COBConnector (COB_TOP1.25), VHCDI (J3.21)
ctrl_i_segment14: COBConnector (COB_TOP1.28), VHCDI (J3.19)
ctrl_i_segment15: COBConnector (COB_TOP1.27), VHCDI (J3.17)
ctrl_i_segment16: COBConnector (COB_TOP1.30), VHCDI (J3.15)
ctrl_i_segment17: COBConnector (COB_TOP1.29), VHCDI (J3.13)
ctrl_i_segment18: COBConnector (COB_TOP2.1), VHCDI (J3.7)
ctrl_i_segment19: COBConnector (COB_TOP1.32), VHCDI (J3.11)
ctrl_i_segment20: COBConnector (COB_TOP1.31), VHCDI (J3.9)
ctrl_i_segment21: COBConnector (COB_TOP2.5), VHCDI (J3.5)
ctrl_i_segment22: COBConnector (COB_TOP2.6), VHCDI (J3.3)
ctrl_i_segment23: COBConnector (COB_TOP2.7), VHCDI (J3.1)
ctrl_i_segment24: COBConnector (COB_TOP2.8), VHCDI (J3.35)
ctrl_i_segment25: COBConnector (COB_TOP2.9), VHCDI (J3.37)
ctrl_i_segment26: COBConnector (COB_TOP2.10), VHCDI (J3.39)
ctrl_i_segment27: COBConnector (COB_TOP2.11), VHCDI (J3.41)
ctrl_i_segment28: COBConnector (COB_TOP2.12), VHCDI (J3.43)
ctrl_i_segment29: COBConnector (COB_TOP2.13), VHCDI (J3.45)
ctrl_i_segment30: COBConnector (COB_TOP2.14), VHCDI (J3.47)
ctrl_i_segment31: COBConnector (COB_TOP2.15), VHCDI (J3.49)
ctrl_i_segment32: COBConnector (COB_TOP2.16), VHCDI (J2.53)
ctrl_i_segment33: COBConnector (COB_TOP2.17), VHCDI (J2.55)
ctrl_i_segment34: COBConnector (COB_TOP2.18), VHCDI (J2.57)
ctrl_i_segment35: COBConnector (COB_TOP2.19), VHCDI (J2.59)
ctrl_i_segment36: COBConnector (COB_TOP2.20), VHCDI (J2.61)
ctrl_i_segment37: COBConnector (COB_TOP2.21), VHCDI (J2.63)
ctrl_i_segment38: COBConnector (COB_TOP2.22), VHCDI (J2.65)
ctrl_i_segment39: COBConnector (COB_TOP2.23), VHCDI (J2.31)
ctrl_i_segment40: COBConnector (COB_TOP2.24), VHCDI (J2.29)
ctrl_i_segment41: COBConnector (COB_TOP2.25), VHCDI (J2.27)
ctrl_i_segment42: COBConnector (COB_TOP2.26), VHCDI (J2.25)
ctrl_i_segment43: COBConnector (COB_TOP2.27), VHCDI (J2.23)
ctrl_i_segment44: COBConnector (COB_TOP2.32), VHCDI (J2.19)
ctrl_i_segment45: COBConnector (COB_TOP2.31), VHCDI (J2.17)
ctrl_i_segment46: COBConnector (COB_BOTTOM2.32), VHCDI (J6.59)
ctrl_i_segment47: COBConnector (COB_BOTTOM2.31), VHCDI (J6.61)
ctrl_i_segment48: COBConnector (COB_BOTTOM2.28), VHCDI (J6.63)
ctrl_i_segment49: COBConnector (COB_BOTTOM2.27), VHCDI (J6.65)
ctrl_i_segment50: COBConnector (COB_BOTTOM2.26), VHCDI (J6.47)
ctrl_i_segment51: COBConnector (COB_BOTTOM2.25), VHCDI (J6.49)
ctrl_i_segment52: COBConnector (COB_BOTTOM2.24), VHCDI (J6.31)
ctrl_i_segment53: COBConnector (COB_BOTTOM2.23), VHCDI (J6.29)
ctrl_i_segment54: COBConnector (COB_BOTTOM2.22), VHCDI (J6.27)
ctrl_i_segment55: COBConnector (COB_BOTTOM2.21), VHCDI (J6.25)
ctrl_i_segment56: COBConnector (COB_BOTTOM2.20), VHCDI (J6.23)
ctrl_i_segment57: COBConnector (COB_BOTTOM2.18), VHCDI (J6.19)
ctrl_i_segment58: COBConnector (COB_BOTTOM2.19), VHCDI (J6.21)
ctrl_i_segment59: COBConnector (COB_BOTTOM2.17), VHCDI (J6.17)
ctrl_i_segment60: COBConnector (COB_BOTTOM2.16), VHCDI (J6.15)
ctrl_i_segment61: COBConnector (COB_BOTTOM2.15), VHCDI (J6.13)
ctrl_i_segment62: COBConnector (COB_BOTTOM2.14), VHCDI (J6.11)
ctrl_i_segment63: COBConnector (COB_BOTTOM2.13), VHCDI (J6.9)
ctrl_i_segment64: COBConnector (COB_BOTTOM2.12), VHCDI (J6.7)
ctrl_i_segment65: COBConnector (COB_BOTTOM2.11), VHCDI (J6.5)
ctrl_i_segment66: COBConnector (COB_BOTTOM2.10), VHCDI (J6.3)
ctrl_i_segment67: COBConnector (COB_BOTTOM2.9), VHCDI (J6.1)
ctrl_i_segment68: COBConnector (COB_BOTTOM2.8), VHCDI (J6.35)
ctrl_i_segment69: COBConnector (COB_BOTTOM2.7), VHCDI (J6.37)
ctrl_i_segment70: COBConnector (COB_BOTTOM2.6), VHCDI (J6.39)
ctrl_i_segment71: COBConnector (COB_BOTTOM2.5), VHCDI (J6.41)
ctrl_i_segment72: COBConnector (COB_BOTTOM2.1), VHCDI (J6.43)
ctrl_i_segment73: COBConnector (COB_BOTTOM1.31), VHCDI (J6.45)
ctrl_i_segment74: COBConnector (COB_BOTTOM1.32), VHCDI (J5.51)
ctrl_i_segment75: COBConnector (COB_BOTTOM1.29), VHCDI (J5.53)
ctrl_i_segment76: COBConnector (COB_BOTTOM1.30), VHCDI (J5.55)
ctrl_i_segment77: COBConnector (COB_BOTTOM1.27), VHCDI (J5.57)
ctrl_i_segment78: COBConnector (COB_BOTTOM1.28), VHCDI (J5.59)
ctrl_i_segment79: COBConnector (COB_BOTTOM1.25), VHCDI (J5.61)
ctrl_i_segment80: COBConnector (COB_BOTTOM1.24), VHCDI (J5.63)
ctrl_i_segment81: COBConnector (COB_BOTTOM1.21), VHCDI (J5.65)
ctrl_i_segment82: COBConnector (COB_BOTTOM1.22), VHCDI (J5.31)
ctrl_i_segment83: COBConnector (COB_BOTTOM1.19), VHCDI (J5.29)
ctrl_i_segment84: COBConnector (COB_BOTTOM1.20), VHCDI (J5.27)
ctrl_i_segment85: COBConnector (COB_BOTTOM1.17), VHCDI (J5.25)
ctrl_i_segment86: COBConnector (COB_BOTTOM1.18), VHCDI (J5.23)
ctrl_i_segment87: COBConnector (COB_BOTTOM1.16), VHCDI (J5.21)
ctrl_i_segment88: COBConnector (COB_BOTTOM1.13), VHCDI (J5.19)
ctrl_i_segment89: COBConnector (COB_BOTTOM1.14), VHCDI (J5.17)
ctrl_i_segment90: COBConnector (COB_BOTTOM1.11), VHCDI (J5.15)
ctrl_i_segment91: COBConnector (COB_BOTTOM1.12), VHCDI (J5.13)
ctrl_i_segment92: COBConnector (COB_BOTTOM1.9), VHCDI (J5.11)
ctrl_i_segment93: COBConnector (COB_BOTTOM1.10), VHCDI (J5.9)
ctrl_i_segment94: COBConnector (COB_BOTTOM1.7), VHCDI (J5.7)
ctrl_i_segment95: COBConnector (COB_BOTTOM1.8), VHCDI (J5.5)
ctrl_ready_o: COBConnector (COB_BOTTOM1.5), VHCDI (J5.3)
ctrl_valid_i: COBConnector (COB_BOTTOM1.6), VHCDI (J5.1)
REP_SEL0: COBConnector (COB_RIGHT2.32), VHCDI (J5.41)
REP_SEL1: COBConnector (COB_RIGHT2.31), VHCDI (J5.39)
REP_SEL2: COBConnector (COB_RIGHT2.30), VHCDI (J5.43)
REP_SEL3: COBConnector (COB_RIGHT2.28), VHCDI (J5.45)
REP_SEL4: COBConnector (COB_RIGHT2.27), VHCDI (J5.47)
REP_SEL5: COBConnector (COB_RIGHT2.26), VHCDI (J5.49)
rst_n: COBConnector (COB_BOTTOM1.1), VHCDI (J5.37)
rst_ni: COBConnector (COB_BOTTOM1.2), VHCDI (J5.35)